# Altium schematic sheet Suply.SchDoc
size A4
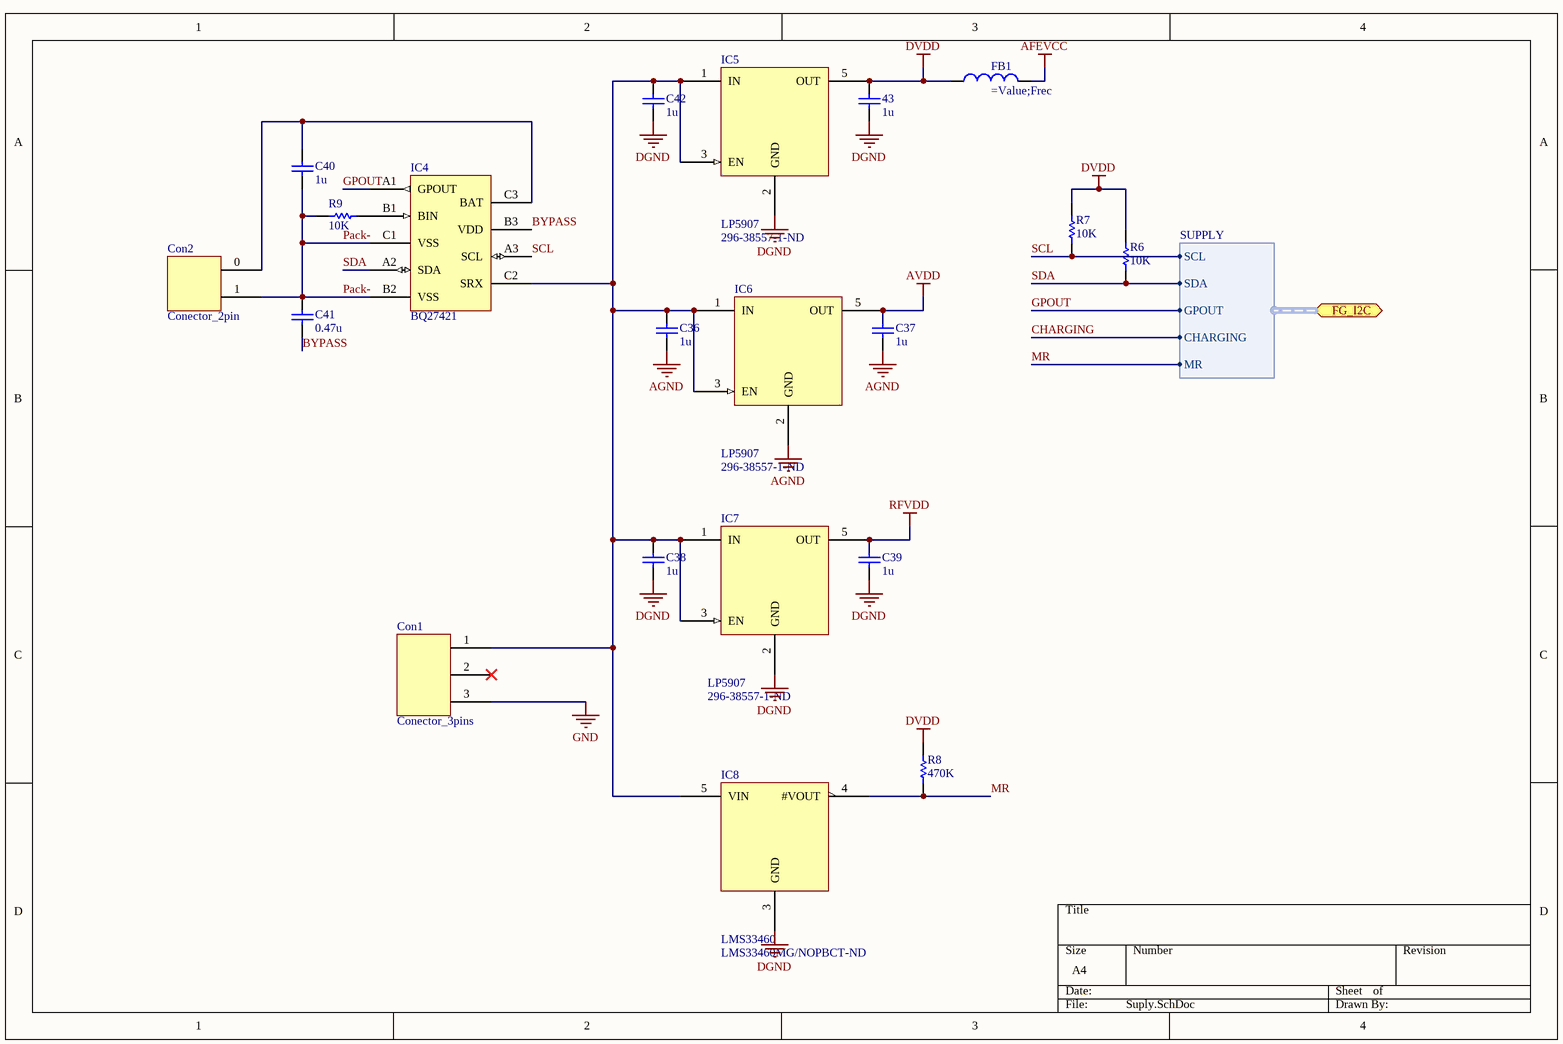
[diagram p0: Suply.SchDoc]

## Parts
43  1u  [C0805]
C36  1u  [C0805]
C37  1u  [C0805]
C38  1u  [C0805]
C39  1u  [C0805]
C40  1u  [C0805]
C41  0.47u  [C0805]
C42  1u  [C0805]
Con1  Conector_3pins
Con2  Conector_2pin
FB1  (no value)  [INDUCTOR-5MM]
IC4  BQ27421  [BQ27421]
IC5  LP5907  Supplier Part Number 1: 296-38557-1-ND  [SOT95P280X145-5N]
IC6  LP5907  Supplier Part Number 1: 296-38557-1-ND  [SOT95P280X145-5N]
IC7  LP5907  Supplier Part Number 1: 296-38557-1-ND  [SOT95P280X145-5N]
IC8  LMS33460  Supplier Part Number 1: LMS33460MG/NOPBCT-ND  [SOT65P210X110-5N]
R6  10K  [R0805]
R7  10K  [R0805]
R8  470K  [R0805]
R9  10K  [R0805]

## Ports
FG_I2C (harness SUPPLY)

## Harnesses
SUPPLY: SDA, SCL, GPOUT, CHARGING, MR

## Nets
AFEVCC: FB1.2
AGND: C36.1 C37.1 IC6.2(GND)
AVDD: C37.2 IC6.5(OUT)
DGND: 43.1 C38.1 C39.1 C42.1 IC5.2(GND) IC7.2(GND) IC8.3(GND)
DVDD: 43.2 FB1.1 IC5.5(OUT) R6.2 R7.2 R8.2
GND: Con1.3
RFVDD: C39.2 IC7.5(OUT)
BYPASS: C41.1 IC4.B3(VDD)
CHARGING: port FG_I2C.CHARGING
GPOUT: IC4.A1(GPOUT) ; port FG_I2C.GPOUT
MR: IC8.4(#VOUT) R8.1 ; port FG_I2C.MR
Pack-: C40.1 C41.2 Con2.1 IC4.B2(VSS) IC4.C1(VSS) R9.1
SCL: IC4.A3(SCL) R7.1 ; port FG_I2C.SCL
SDA: IC4.A2(SDA) R6.1 ; port FG_I2C.SDA
NetC36_2: C36.2 C38.2 C42.2 Con1.1 IC4.C2(SRX) IC5.1(IN) IC5.3(EN) IC6.1(IN) IC6.3(EN) IC7.1(IN) IC7.3(EN) IC8.5(VIN)
NetC40_2: C40.2 Con2.0 IC4.C3(BAT)
NetIC4_B1: IC4.B1(BIN) R9.2

Not connected (* = marked no-connect by the designer): Con1 2*

## Library data of the parts
43 C40 C42 = Capacitor: Value: 1u; Rated Voltage: *
C36-C39 C41 = Capacitor: Value: 100p; Rated Voltage: *
Con1 = Conector_3pins: Conector
FB1 = Ferrite: Value: 100 omh 1Mhz; Saturation current: 500mA
R6 R7 R9 = Resistor: Value: 10K; Power: *
R8 = Resistor: Value: 1K; Power: *
IC5-IC7 = LP5907: Supplier 1: Digi-Key
IC8 = LMS33460: Supplier 1: Digi-Key